# Altium schematic sheet [02] - STM32.SchDoc
size A
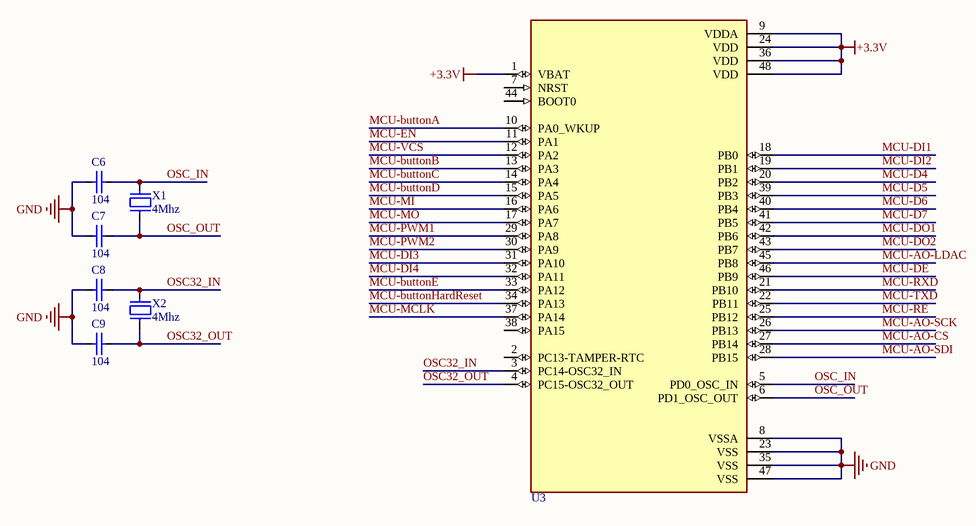
[diagram p0: [02] - STM32.SchDoc]

## Parts
C6  104  [CAP_0402]
C7  104  [CAP_0402]
C8  104  [CAP_0402]
C9  104  [CAP_0402]
U3  STM32  [LQFP 48]  (value not drawn)
X1  4Mhz  [XT2]
X2  4Mhz  [XT2]

## Nets
+3.3V: U3.1(VBAT) U3.9(VDDA) U3.24(VDD) U3.36(VDD) U3.48(VDD)
GND: C6.1 C7.1 C8.1 C9.1 U3.8(VSSA) U3.23(VSS) U3.35(VSS) U3.47(VSS)
MCU-AO-CS: U3.27(PB14)
MCU-AO-LDAC: U3.45(PB8)
MCU-AO-SCK: U3.26(PB13)
MCU-AO-SDI: U3.28(PB15)
MCU-buttonA: U3.10(PA0_WKUP)
MCU-buttonB: U3.13(PA3)
MCU-buttonC: U3.14(PA4)
MCU-buttonD: U3.15(PA5)
MCU-buttonE: U3.33(PA12)
MCU-buttonHardReset: U3.34(PA13)
MCU-D4: U3.20(PB2)
MCU-D5: U3.39(PB3)
MCU-D6: U3.40(PB4)
MCU-D7: U3.41(PB5)
MCU-DE: U3.46(PB9)
MCU-DI1: U3.18(PB0)
MCU-DI2: U3.19(PB1)
MCU-DI3: U3.31(PA10)
MCU-DI4: U3.32(PA11)
MCU-DO1: U3.42(PB6)
MCU-DO2: U3.43(PB7)
MCU-EN: U3.11(PA1)
MCU-MCLK: U3.37(PA14)
MCU-MI: U3.16(PA6)
MCU-MO: U3.17(PA7)
MCU-PWM1: U3.29(PA8)
MCU-PWM2: U3.30(PA9)
MCU-RE: U3.25(PB12)
MCU-RXD: U3.21(PB10)
MCU-TXD: U3.22(PB11)
MCU-VCS: U3.12(PA2)
OSC32_IN: C8.2 U3.3(PC14-OSC32_IN) X2.2
OSC32_OUT: C9.2 U3.4(PC15-OSC32_OUT) X2.1
OSC_IN: C6.2 U3.5(PD0_OSC_IN) X1.2
OSC_OUT: C7.2 U3.6(PD1_OSC_OUT) X1.1

Not connected (* = marked no-connect by the designer): U3 2(PC13-TAMPER-RTC) 7(NRST) 38(PA15) 44(BOOT0)

## Library data of the parts
C6-C9 = CapSMD: Capacitor; Value: 33p; Published: 8-Jun-2000; LatestRevisionDate: 17-Jul-2002; LatestRevisionNote: Re-released for DXP Platform.; PackageReference: RAD-0.3; Publisher: Altium Limited
U3 = STM32F103C8T6: STM32 ARM-based 32-bit MCU with 64 Kbytes Flash, 64-pin LQFP, Industrial Temperature
X1 X2 = XT2: Crystal For all Crystal 2pin.; Value: 4Mhz